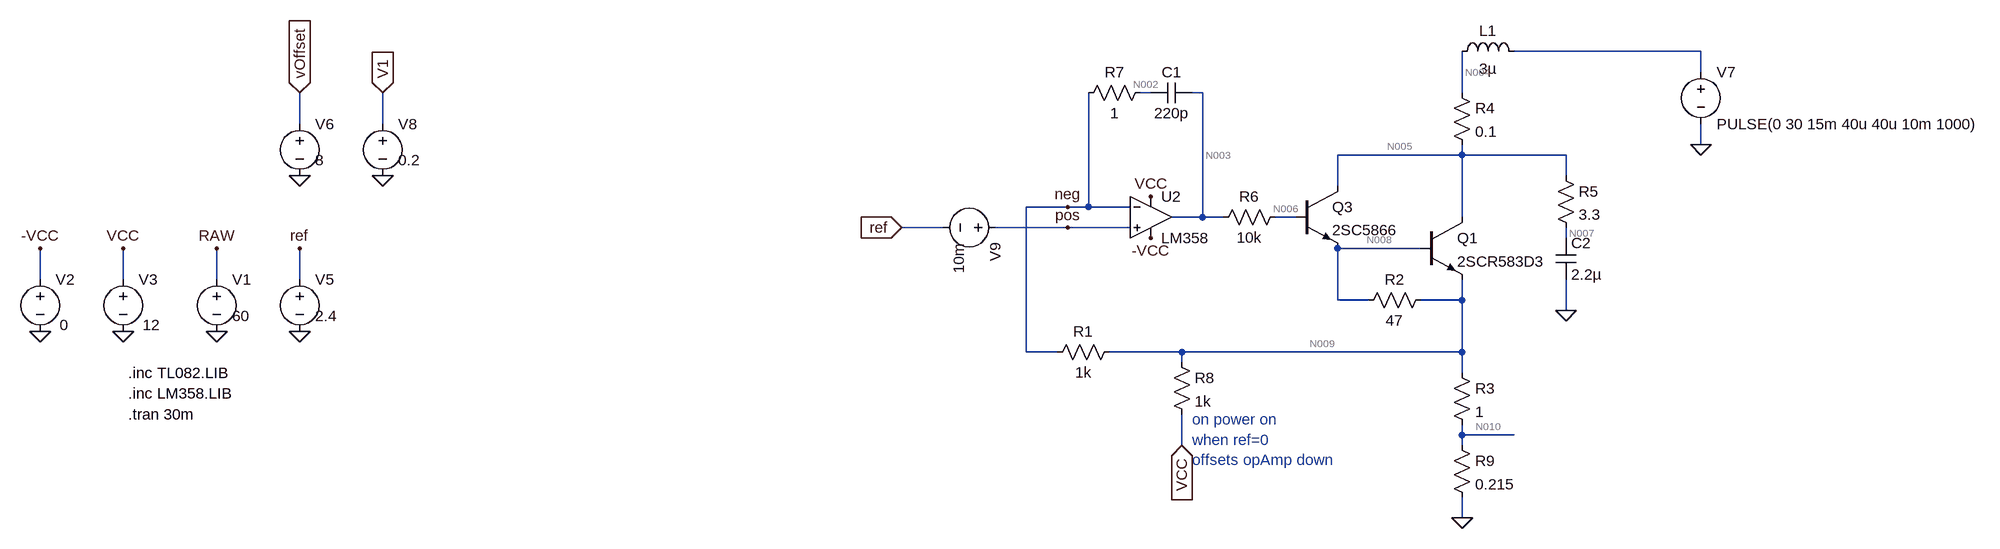
[diagram p0: schematic darlington-bjt-stability-pulse.asc]
darlington-bjt-stability-pulse.asc, the LTspice schematic file:
Version 4
SHEET 1 3784 724
WIRE 1472 -368 1184 -368
WIRE 1472 -336 1472 -368
WIRE 624 -304 608 -304
WIRE 704 -304 688 -304
WIRE 1104 -304 1104 -368
WIRE -688 -256 -688 -304
WIRE -560 -256 -560 -304
WIRE 1472 -224 1472 -256
WIRE 1104 -208 1104 -224
WIRE 1104 -208 912 -208
WIRE 1264 -208 1104 -208
WIRE 1264 -176 1264 -208
WIRE 912 -160 912 -208
WIRE 496 -128 432 -128
WIRE 528 -128 528 -304
WIRE 528 -128 496 -128
WIRE 592 -128 528 -128
WIRE 704 -112 704 -304
WIRE 704 -112 656 -112
WIRE 736 -112 704 -112
WIRE 848 -112 816 -112
WIRE 1104 -112 1104 -208
WIRE 304 -96 240 -96
WIRE 496 -96 384 -96
WIRE 592 -96 496 -96
WIRE 1264 -80 1264 -96
WIRE 1040 -64 912 -64
WIRE -1088 -16 -1088 -64
WIRE -960 -16 -960 -64
WIRE -816 -16 -816 -64
WIRE -688 -16 -688 -64
WIRE 912 16 912 -64
WIRE 960 16 912 16
WIRE 1104 16 1104 -16
WIRE 1104 16 1040 16
WIRE 1264 32 1264 -16
WIRE 432 96 432 -128
WIRE 480 96 432 96
WIRE 672 96 560 96
WIRE 1104 96 1104 16
WIRE 1104 96 672 96
WIRE 672 112 672 96
WIRE 1104 128 1104 96
WIRE 1104 224 1104 208
WIRE 1184 224 1104 224
WIRE 672 240 672 192
WIRE 1104 240 1104 224
WIRE 1104 352 1104 320
FLAG -816 64 0
FLAG -816 -64 RAW
FLAG 624 -144 VCC
FLAG -960 64 0
FLAG -960 -64 VCC
FLAG 1104 352 0
FLAG -1088 64 0
FLAG -1088 -64 -VCC
FLAG 624 -80 -VCC
FLAG -688 64 0
FLAG -688 -64 ref
FLAG 240 -96 ref
IOPIN 240 -96 In
FLAG 1264 32 0
FLAG -688 -304 vOffset
IOPIN -688 -304 In
FLAG -688 -176 0
FLAG 1472 -224 0
FLAG -560 -304 V1
IOPIN -560 -304 In
FLAG -560 -176 0
FLAG 496 -96 pos
FLAG 496 -128 neg
FLAG 672 240 VCC
IOPIN 672 240 In
SYMBOL voltage -816 -32 R0
WINDOW 123 24 44 Left 2
WINDOW 39 0 0 Left 0
WINDOW 3 24 72 Left 2
SYMATTR Value 60
SYMATTR InstName V1
SYMBOL voltage -960 -32 R0
WINDOW 123 24 44 Left 2
WINDOW 39 0 0 Left 0
WINDOW 3 30 86 Left 2
SYMATTR Value 12
SYMATTR InstName V3
SYMBOL res 1088 112 R0
SYMATTR InstName R3
SYMATTR Value 1
SYMBOL voltage -1088 -32 R0
WINDOW 123 24 44 Left 2
WINDOW 39 0 0 Left 0
WINDOW 3 30 86 Left 2
SYMATTR Value 0
SYMATTR InstName V2
SYMBOL voltage -688 -32 R0
WINDOW 123 60 55 Left 2
WINDOW 39 0 0 Left 0
WINDOW 3 24 72 Left 2
SYMATTR Value 2.4
SYMATTR InstName V5
SYMBOL ind 1088 -352 R270
WINDOW 0 32 56 VTop 2
WINDOW 3 5 56 VBottom 2
SYMATTR InstName L1
SYMATTR Value 3µ
SYMBOL res 464 112 R270
WINDOW 0 32 56 VTop 2
WINDOW 3 0 56 VBottom 2
SYMATTR InstName R1
SYMATTR Value 1k
SYMBOL cap 1248 -80 R0
SYMATTR InstName C2
SYMATTR Value 2.2µ
SYMBOL res 1248 -192 R0
SYMATTR InstName R5
SYMATTR Value 3.3
SYMBOL cap 688 -320 R90
WINDOW 0 0 32 VBottom 2
WINDOW 3 32 32 VTop 2
SYMATTR InstName C1
SYMATTR Value 220p
SYMBOL res 944 32 R270
WINDOW 0 32 56 VTop 2
WINDOW 3 0 56 VBottom 2
SYMATTR InstName R2
SYMATTR Value 47
SYMBOL npn 848 -160 R0
SYMATTR InstName Q3
SYMATTR Value 2SC5866
SYMBOL npn 1040 -112 R0
SYMATTR InstName Q1
SYMATTR Value 2SCR583D3
SYMBOL res 1088 -320 R0
SYMATTR InstName R4
SYMATTR Value 0.1
SYMBOL res 720 -96 R270
WINDOW 0 32 56 VTop 2
WINDOW 3 0 56 VBottom 2
SYMATTR InstName R6
SYMATTR Value 10k
SYMBOL voltage -688 -272 R0
WINDOW 123 24 44 Left 2
WINDOW 39 0 0 Left 0
WINDOW 3 24 72 Left 2
SYMATTR Value 8
SYMATTR InstName V6
SYMBOL VOLTAGE 1472 -352 R0
WINDOW 123 0 0 Left 0
WINDOW 39 0 0 Left 0
SYMATTR InstName V7
SYMATTR Value PULSE(0 30 15m 40u 40u 10m 1000)
SYMBOL voltage -560 -272 R0
WINDOW 123 24 44 Left 2
WINDOW 39 0 0 Left 0
WINDOW 3 24 72 Left 2
SYMATTR Value 0.2
SYMATTR InstName V8
SYMBOL OpAmps\\opamp2 624 -176 R0
SYMATTR InstName U2
SYMATTR Value LM358
SYMBOL voltage 400 -96 R90
WINDOW 123 60 55 Left 2
WINDOW 39 0 0 Left 0
WINDOW 3 24 72 Left 2
SYMATTR Value 10m
SYMATTR InstName V9
SYMBOL res 624 -320 R90
WINDOW 0 0 56 VBottom 2
WINDOW 3 32 56 VTop 2
SYMATTR InstName R7
SYMATTR Value 1
SYMBOL res 656 96 R0
SYMATTR InstName R8
SYMATTR Value 1k
SYMBOL res 1088 224 R0
SYMATTR InstName R9
SYMATTR Value 0.215
TEXT -952 160 Left 2 !.inc LM358.LIB
TEXT -952 192 Left 2 !.tran 30m
TEXT -952 128 Left 2 !.inc TL082.LIB
TEXT 688 200 Left 2 ;on power on\nwhen ref=0\noffsets opAmp down

The netlist it stands for:
* darlington-bjt-stability-pulse.asc
V1 RAW 0 60
V3 VCC 0 12
R3 N009 N010 1
V2 -VCC 0 0
V5 ref 0 2.4
L1 N004 N001 3µ
R1 neg N009 1k
C2 N007 0 2.2µ
R5 N005 N007 3.3
C1 N003 N002 220p
R2 N008 N009 47
Q3 N005 N006 N008 0 2SC5866
Q1 N005 N008 N009 0 2SCR583D3
R4 N004 N005 0.1
R6 N003 N006 10k
V6 vOffset 0 8
V7 N001 0 PULSE(0 30 15m 40u 40u 10m 1000)
V8 V1 0 0.2
XU2 pos neg VCC -VCC N003 LM358  ; pins In+ In- V+ V- OUT
V9 pos ref 10m
R7 N002 neg 1
R8 N009 VCC 1k
R9 N010 0 0.215
.model NPN NPN
.model PNP PNP
.lib standard.bjt
.inc LM358.LIB
.tran 30m
.inc TL082.LIB
* on power on
* when ref=0
* offsets opAmp down
.backanno
.end

* Results of the author's LTspice run, read from the files saved beside the schematic
* Operating Point, zero values left out:
*   V(raw) = 60 V
*   V(vcc) = 12 V
*   V(n009) = 14.23 mV
*   V(n010) = 2.519 mV
*   V(ref) = 2.4 V
*   V(n004) = 1.283 µV
*   V(neg) = 14.24 mV
*   V(n007) = 129.6 µV
*   V(n005) = 129.6 µV
*   V(n003) = 10.74 V
*   V(n002) = 14.24 mV
*   V(n008) = 1.484 mV
*   V(n006) = 618.1 mV
*   V(voffset) = 8 V
*   V(v1) = 200 mV
*   V(pos) = 2.41 V
*   Ic(Q3) = -1.283 mA
*   Ib(Q3) = 1.012 mA
*   Ie(Q3) = 271.3 µA
*   Ic(Q1) = -1.24 pA
*   Ie(Q1) = 1.423 pA
*   I(L1) = 1.283 mA
*   I(R3) = 11.71 mA
*   I(R1) = 9.506 nA
*   I(R2) = -271.3 µA
*   I(R4) = -1.283 mA
*   I(R6) = 1.012 mA
*   I(R8) = -11.99 mA
*   I(R9) = 11.71 mA
*   I(V3) = -13.3 mA
*   I(V2) = 300 µA
*   I(V5) = 10 nA
*   I(V7) = 1.283 mA
*   I(V9) = 10 nA
*   Ix(u2:IN+) = -10 nA
*   Ix(u2:IN-) = -9.506 nA
*   Ix(u2:VCC) = 1.312 mA
*   Ix(u2:VEE) = -300 µA
*   Ix(u2:OUT) = -1.012 mA
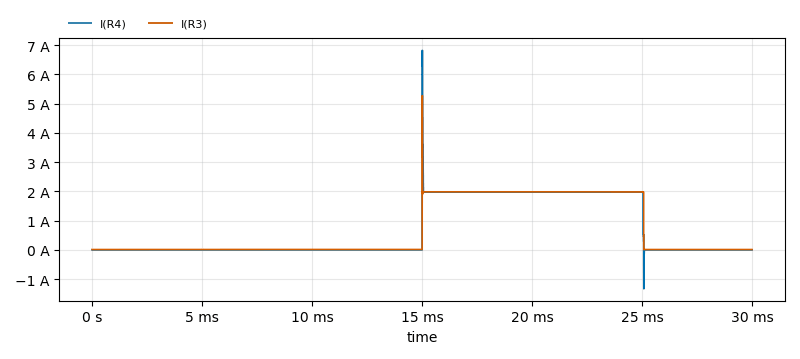
[diagram p1: Transient Analysis of darlington-bjt-stability-pulse.asc, plotted from the saved traces]
* Transient Analysis, 1 run:
*   I(R4): min -1.331 A, max 6.82 A, average 663 mA, rms 1.151 A, last -1.283 mA
*   I(R3): min 6.777 mA, max 5.274 A, average 674.9 mA, rms 1.152 A, last 11.71 mA